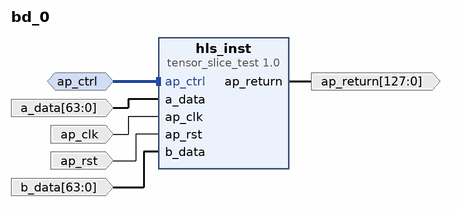
[diagram p0: block diagram of the top level]
# Vivado block design bd_0, xcvu9p-flga2104-2-i, Vivado 2024.1
create_bd_design bd_0

create_bd_intf_port -mode Slave -vlnv xilinx.com:interface:acc_handshake_rtl:1.0 ap_ctrl
create_bd_port -dir I -from 63 -to 0 -type data a_data
create_bd_port -dir I -type clk ap_clk
set_property -dict {CONFIG.FREQ_HZ 200000000.0} [get_bd_ports ap_clk]
create_bd_port -dir O -from 127 -to 0 -type data ap_return
create_bd_port -dir I -type rst ap_rst
set_property -dict {CONFIG.POLARITY ACTIVE_HIGH} [get_bd_ports ap_rst]
create_bd_port -dir I -from 63 -to 0 -type data b_data

create_bd_cell -type ip -vlnv xilinx.com:hls:tensor_slice_test:1.0 hls_inst

# ---- connections ----

connect_bd_intf_net -intf_net ap_ctrl_0_1 [get_bd_intf_ports ap_ctrl] [get_bd_intf_pins hls_inst/ap_ctrl]
connect_bd_net -net a_data_0_1 [get_bd_ports a_data] [get_bd_pins hls_inst/a_data]
connect_bd_net -net ap_clk_0_1 [get_bd_ports ap_clk] [get_bd_pins hls_inst/ap_clk]
connect_bd_net -net ap_rst_0_1 [get_bd_ports ap_rst] [get_bd_pins hls_inst/ap_rst]
connect_bd_net -net b_data_0_1 [get_bd_ports b_data] [get_bd_pins hls_inst/b_data]
connect_bd_net [get_bd_pins hls_inst/ap_return] [get_bd_ports ap_return]

validate_bd_design
save_bd_design
